# EAGLE design Schema IoT project (EAGLE 9.6.2)
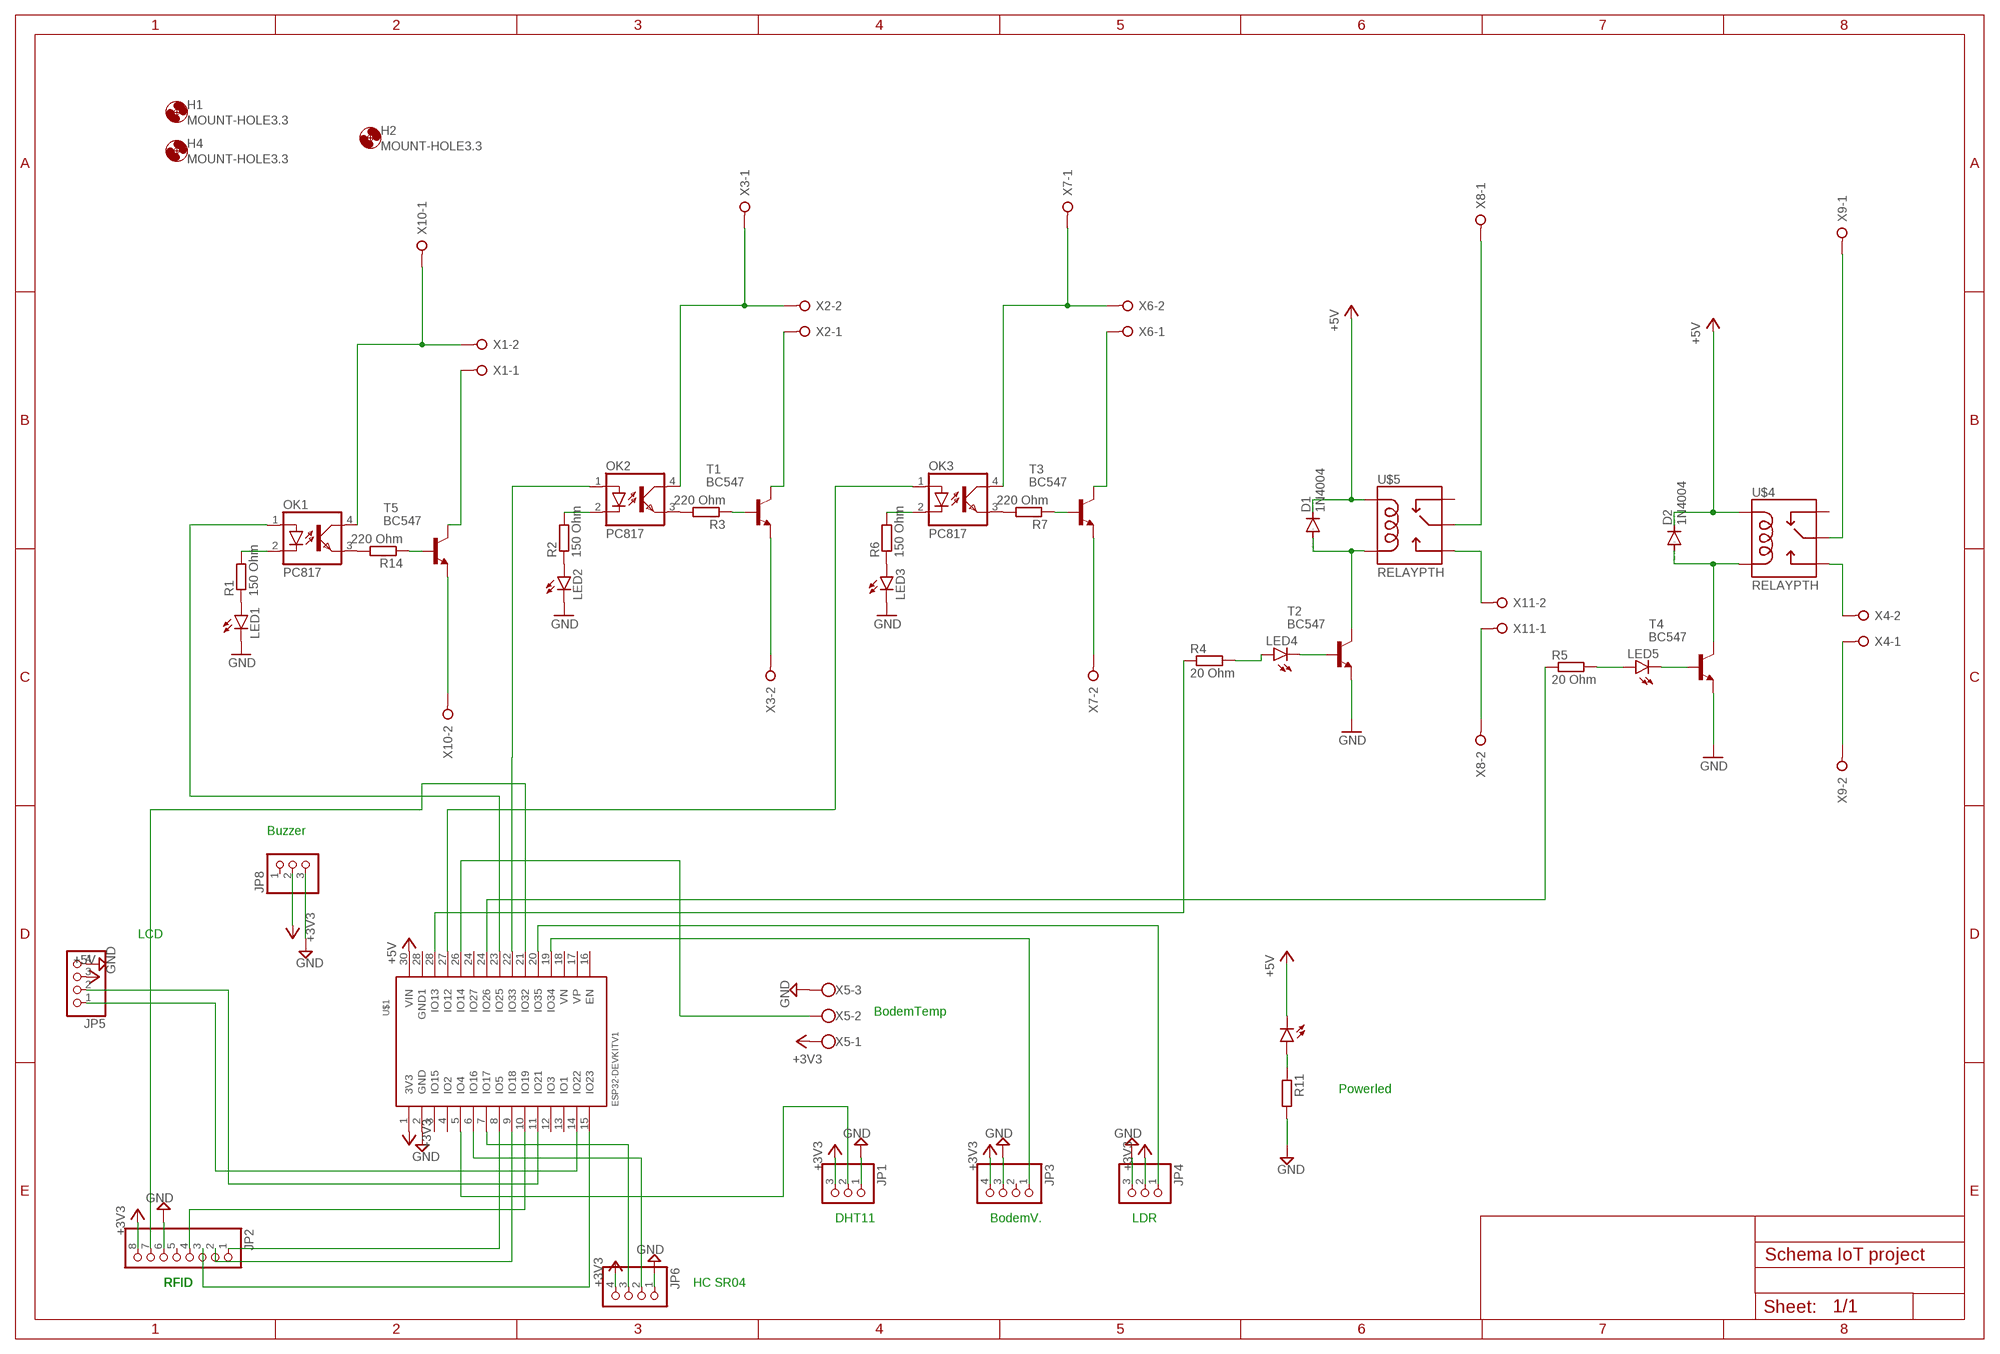
[diagram p0: schematic, sheet 1]

## Parts
D1  1N4004  [DO41-10]
D2  1N4004  [DO41-10]
H1  MOUNT-HOLE3.3  [3,3]
H2  MOUNT-HOLE3.3  [3,3]
H4  MOUNT-HOLE3.3  [3,3]
JP1  PINHD-1X3  [1X03]
JP2  PINHD-1X8  [1X08]
JP3  PINHD-1X4  [1X04]
JP4  PINHD-1X3  [1X03]
JP5  PINHD-1X4  [1X04]
JP6  PINHD-1X4  [1X04]
JP8  PINHD-1X3  [1X03]
LED1  LED5MM  [LED5MM]
LED2  LED5MM  [LED5MM]
LED3  LED5MM  [LED5MM]
LED4  LED5MM  [LED5MM]
LED5  LED5MM  [LED5MM]
OK1  PC817  [DIL04]
OK2  PC817  [DIL04]
OK3  PC817  [DIL04]
PWRLEDRASPBERRYPI2  LED5MM  [LED5MM]
R1  150 Ohm  R-EU_0207/10  [0207/10]
R2  150 Ohm  R-EU_0207/10  [0207/10]
R3  220 Ohm  R-EU_0207/10  [0207/10]
R4  20 Ohm  R-EU_0207/10  [0207/10]
R5  20 Ohm  R-EU_0207/10  [0207/10]
R6  150 Ohm  R-EU_0207/10  [0207/10]
R7  220 Ohm  R-EU_0207/10  [0207/10]
R11  R-EU_0207/10  [0207/10]
R14  220 Ohm  R-EU_0207/10  [0207/10]
T1  BC547  [TO92]
T2  BC547  [TO92]
T3  BC547  [TO92]
T4  BC547  [TO92]
T5  BC547  [TO92]
U$1  ESP32DEVKITV1  [ESP32-DEVKITV1]
U$4  RELAYPTH  [SRD-05VDC-SL-C]
U$5  RELAYPTH  [SRD-05VDC-SL-C]
X1  W237-02P  [W237-132]
X2  W237-02P  [W237-132]
X3  W237-02P  [W237-132]
X4  W237-02P  [W237-132]
X5  W237-103  [W237-103]
X6  W237-02P  [W237-132]
X7  W237-02P  [W237-132]
X8  W237-02P  [W237-132]
X9  W237-02P  [W237-132]
X10  W237-02P  [W237-132]
X11  W237-02P  [W237-132]

## Nets
+3V3: JP1.3 JP2.8 JP3.4 JP4.2 JP6.4 JP8.2 U$1.1(3V3) X5.1
+5V: D1.C D2.C JP5.3 PWRLEDRASPBERRYPI2.K(C) U$1.30(VIN) U$4.COIL1 U$5.COIL1
GND: JP1.1 JP2.6 JP3.3 JP4.3 JP5.4 JP6.1 JP8.3 LED1.K(C) LED2.K(C) LED3.K(C) R11.2 T2.1(E) T4.1(E) U$1.2(GND) X5.3
N$1: OK1.4(COL) X1.2 X10.1
N$2: LED2.A R2.1
N$3: OK2.1(A)
N$4: D1.A T2.3(C) U$5.COIL0
N$5: OK2.4(COL) X2.2 X3.1
N$6: OK1.3(EMIT) R14.2
N$7: OK2.3(EMIT) R3.2
N$8: R3.1 T1.2(B)
N$9: T1.3(C) X2.1
N$10: D2.A T4.3(C) U$4.COIL0
N$11: JP3.1 U$1.19(IO34)
N$12: LED1.A R1.1
N$13: R14.1 T5.2(B)
N$14: T1.1(E) X3.2
N$15: PWRLEDRASPBERRYPI2.A R11.1
N$16: OK2.2(C) R2.2
N$17: T5.3(C) X1.1
N$18: LED4.K(C) T2.2(B)
N$19: R5.1 U$1.24(IO26)
N$20: LED4.A R4.2
N$21: T5.1(E) X10.2
N$22: JP5.2 U$1.11(IO21)
N$23: LED3.A R6.1
N$24: OK3.1(A) U$1.27(IO12)
N$25: U$4.SWCOMMON X9.1
N$26: U$5.SWCOMMON X8.1
N$27: OK1.2(C) R1.2
N$28: R4.1 U$1.28(IO13)
N$29: OK3.4(COL) X6.2 X7.1
N$30: U$1.22(IO33)
N$31: OK3.3(EMIT) R7.2
N$32: X8.2 X11.1
N$33: U$1.26(IO14) X5.2
N$34: JP6.3 U$1.7(IO17)
N$35: JP4.1 U$1.20(IO35)
N$36: JP2.7 U$1.21(IO32)
N$37: JP2.4 U$1.10(IO19)
N$39: JP6.2 U$1.6(IO16)
N$40: R7.1 T3.2(B)
N$41: JP1.2 U$1.5(IO4)
N$43: JP5.1 U$1.14(IO22)
N$44: T3.3(C) X6.1
N$45: U$5.SWOPEN X11.2
N$46: U$4.SWOPEN X4.2
N$47: T3.1(E) X7.2
N$48: OK3.2(C) R6.2
N$49: X4.1 X9.2
N$50: LED5.A R5.2
N$51: LED5.K(C) T4.2(B)
N$52: JP2.3 U$1.15(IO23)
N$53: JP2.2 U$1.9(IO18)
N$54: JP2.1 U$1.8(IO5)
N$58: OK1.1(A) U$1.23(IO25)
Unconnected: JP2.5 JP3.2 JP8.1 U$1.3(IO15) U$1.4(IO2) U$1.12(IO3) U$1.13(IO1) U$1.16(EN) U$1.17(VP) U$1.18(VN) U$1.24(IO27) U$1.28(GND1) U$4.SWCLOSED(SWCLOSE) U$5.SWCLOSED(SWCLOSE)

## Notes on the sheet
- Buzzer
- LCD
- BodemTemp
- Powerled
- DHT11 | BodemV. | LDR
- RFID | RFID | RFID | HC SR04

## Library data of the parts
D1 D2 = diode:1N4004: DIODE general purpose rectifier, 1 A
H1 H2 H4 = holes:MOUNT-HOLE: MOUNTING HOLE with drill center marker
JP1 JP4 JP8 = pinhead:PINHD-1X3: PIN HEADER
JP2 = pinhead:PINHD-1X8: PIN HEADER
JP3 JP5 JP6 = pinhead:PINHD-1X4: PIN HEADER
LED1-LED5 PWRLEDRASPBERRYPI2 = led:LED: LED OSRAM: - CHIPLED LG R971, LG N971, LY N971, LG Q971, LY Q971, LO R971, LY R971 LH N974, LH R974 LS Q976, LO Q976, LY Q976 LO Q996 - Hyper CHIPLED LW Q18S LB Q993, LB Q99A, LB R99A - SideLED LS A670, LO A670, LY A670, LG A670, LP A670 LB A673, LV A673, LT A673, LW A673 LH A674 LY A675 LS A676, LA A676, LO A676, LY A676, LW A676 LS A679, LY A679, LG A679 - Hyper Micro SIDELED® LS Y876, LA Y876, LO Y876, LY Y876 LT Y87S - SmartLED LW L88C, LW L88S LB L89C, LB L89S, LG L890 LS L89K, LO L89K, LY L89K LS L896, LA L896, LO L896, LY L896 - TOPLED LS T670, LO T670, LY T670, LG T670, LP T670 LSG T670, LSP T670, LSY T670, LOP T670, LYG T670 LG T671, LOG T671, LSG T671 LB T673, LV T673, LT T673, LW T673 LH T674 LS T676, LA T676, LO T676, LY T676, LB T676, LH T676, LSB T676, LW T676 LB T67C, LV T67C, LT T67C, LS T67K, LO T67K, LY T67K, LW E67C LS E67B, LA E67B, LO E67B, LY E67B, LB E67C, LV E67C, LT E67C LW T67C LS T679, LY T679, LG T679 LS T770, LO T770, LY T770, LG T770, LP T770 LB T773, LV T773, LT T773, LW T773 LH T774 LS E675, LA E675, LY E675, LS T675 LS T776, LA T776, LO T776, LY T776, LB T776 LHGB T686 LT T68C, LB T68C - Hyper Mini TOPLED® LB M676 - Mini TOPLED Santana® LG M470 LS M47K, LO M47K, LY M47K Source: http://www.osram.convergy.de LUXEON: - LUMILED® LXK2-PW12-R00, LXK2-PW12-S00, LXK2-PW14-U00, LXK2-PW14-V00 LXK2-PM12-R00, LXK2-PM12-S00, LXK2-PM14-U00 LXK2-PE12-Q00, LXK2-PE12-R00, LXK2-PE12-S00, LXK2-PE14-T00, LXK2-PE14-U00 LXK2-PB12-K00, LXK2-PB12-L00, LXK2-PB12-M00, LXK2-PB14-N00, LXK2-PB14-P00, LXK2-PB14-Q00 LXK2-PR12-L00, LXK2-PR12-M00, LXK2-PR14-Q00, LXK2-PR14-R00 LXK2-PD12-Q00, LXK2-PD12-R00, LXK2-PD12-S00 LXK2-PH12-R00, LXK2-PH12-S00 LXK2-PL12-P00, LXK2-PL12-Q00, LXK2-PL12-R00 Source: www.luxeon.com KINGBRIGHT: KA-3528ASYC Source: www.kingbright.com
OK1-OK3 = optocoupler:PC817: SHARP OPTO COUPLER; MPN: PC817X4J000F; OC_FARNELL: 9707727; OC_NEWARK: 97K7059
R1-R7 R11 R14 = rcl:R-EU_: RESISTOR, European symbol; SPICEPREFIX: R
T1-T5 = transistor:BC547: NPN TRANSISTOR
U$1 = ESP32-DEVKITV1:ESP32DEVKITV1
U$4 U$5 = SRD-05VDC-SL-C:RELAY: SPDT relay (COM-00101)
X1-X4 X6-X11 = con-wago-508:W237-02P: WAGO SREW CLAMP; OC_FARNELL: unknown; OC_NEWARK: unknown
X5 = con-wago-500:W237-103: WAGO SCREW CLAMP; MPN: 237-103; OC_FARNELL: unknown; OC_NEWARK: 18M7116

## Board
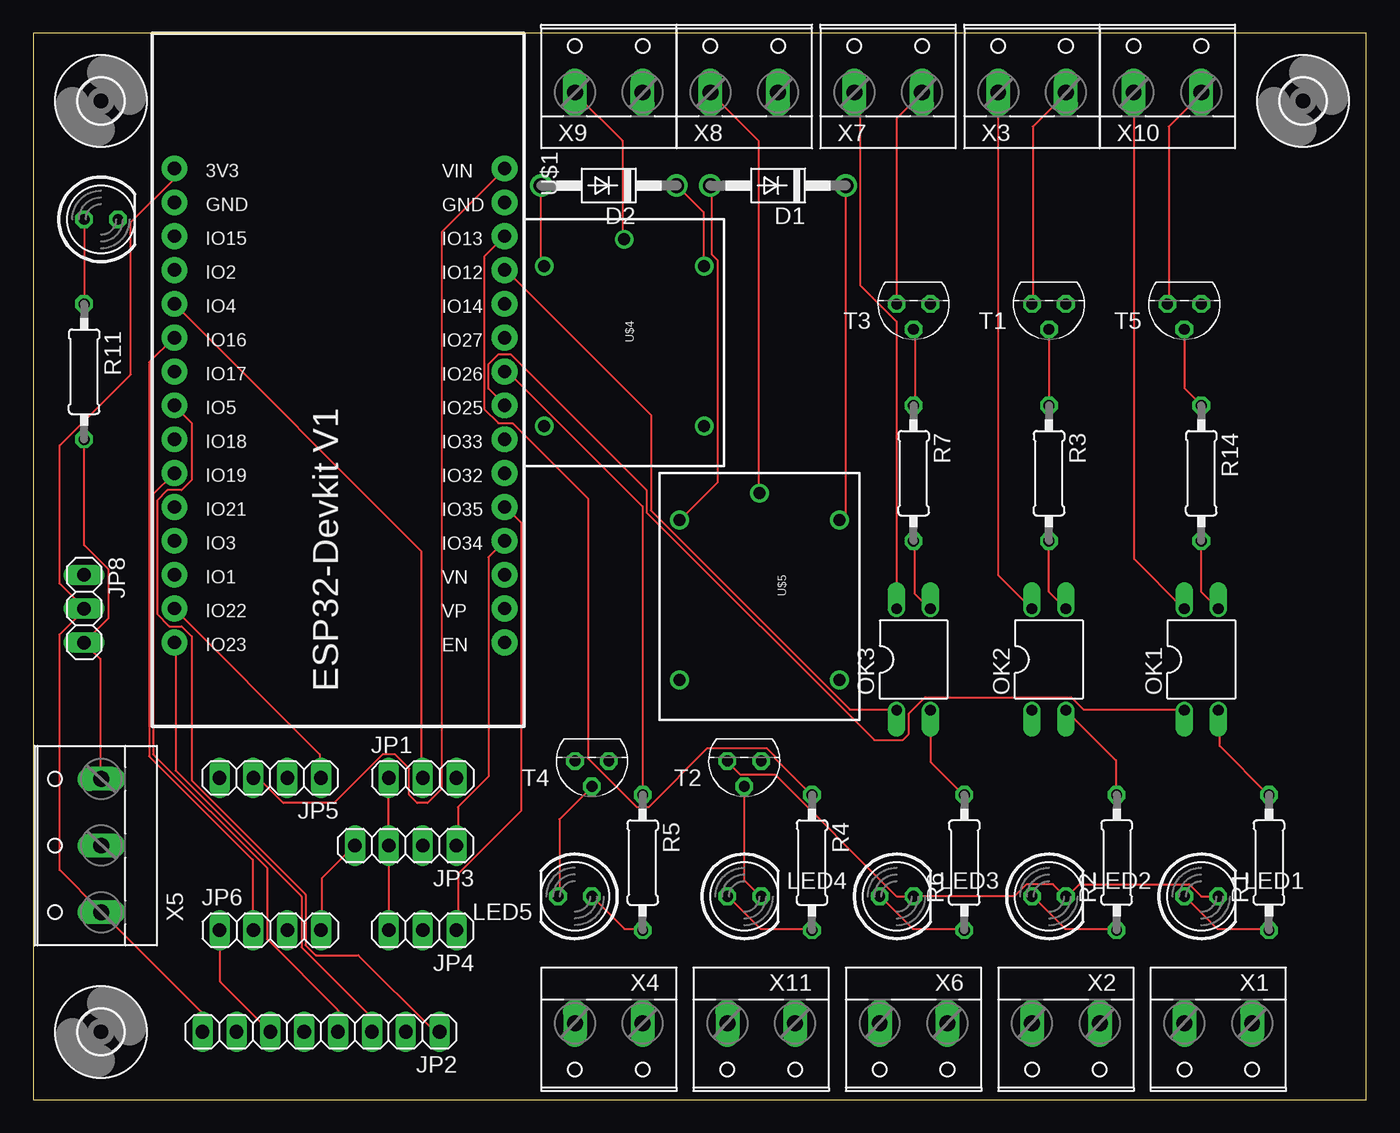
[diagram p1: board, top side]
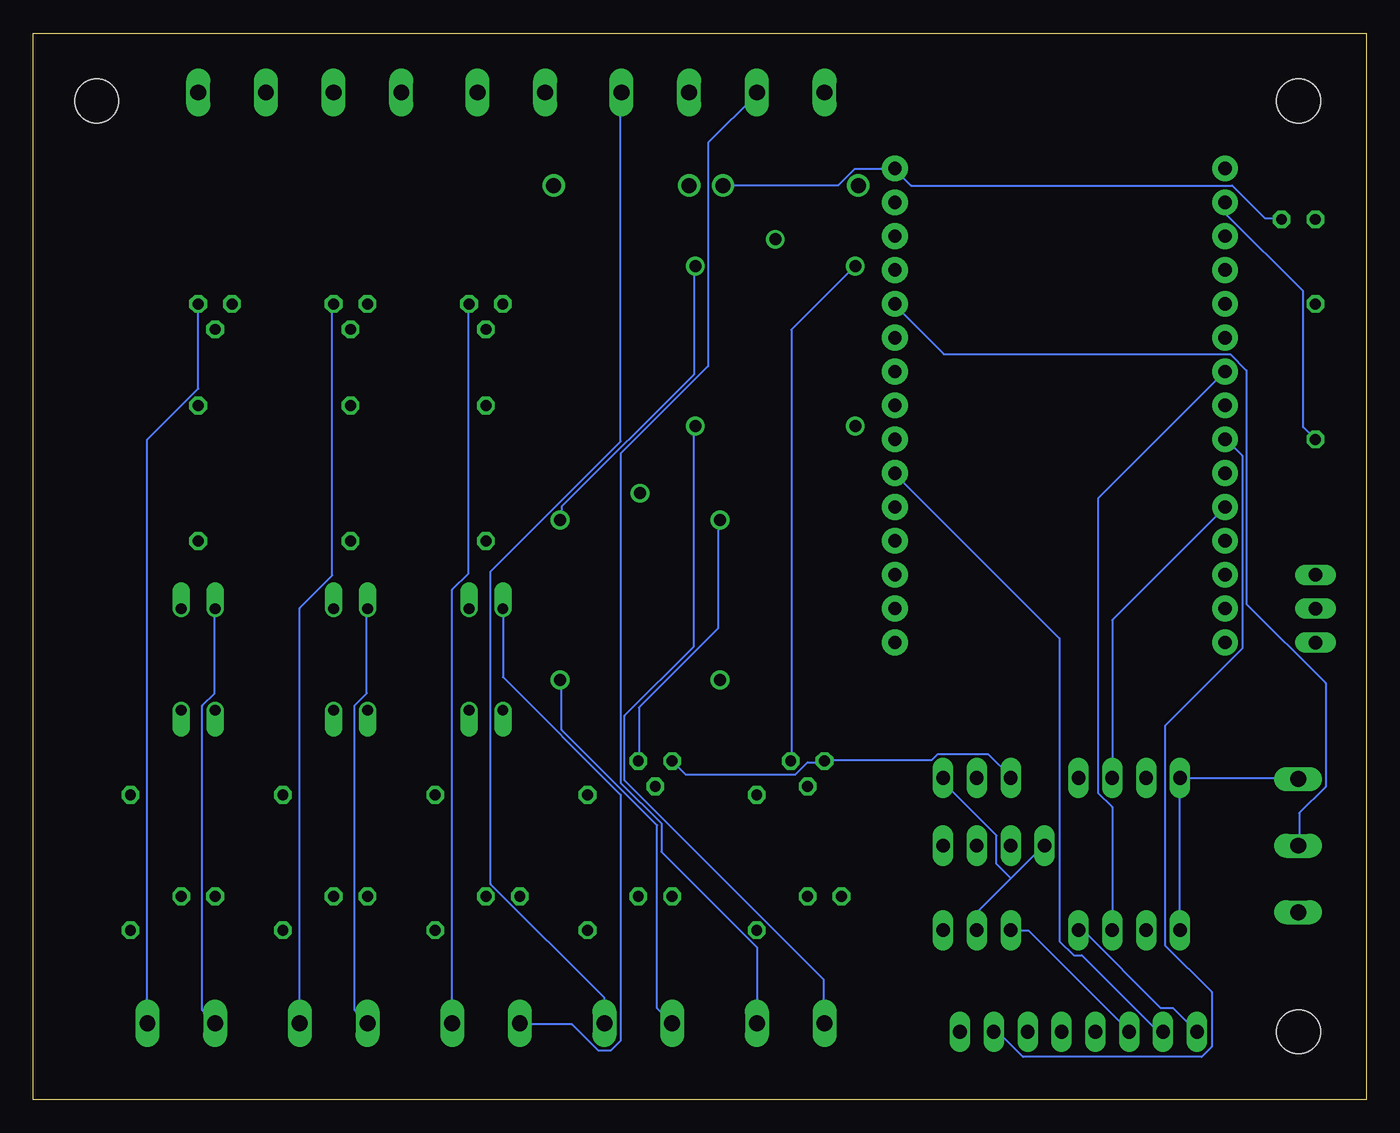
[diagram p2: board, bottom side, seen from below]

Size 100 x 80 mm. Coordinates in mm from the lower left corner, seen from the top.
Outline: 0,0 100,0 100,80 0,80 0,0
Copper layers (1*16): Top 0.035mm / dielectric 1.5mm / Bottom 0.035mm
Design rules "default": minimum track width 6mil, minimum drill 0.35mm, track to track 6mil, track to pad 6mil, pad to pad 6mil, via to via 6mil, smd to smd 6mil, copper to edge 40mil, drill to drill 6mil, minimum pad ring 10mil, minimum via ring 8mil, stop-mask expansion 4mil, vias tented up to drill 0mil, thermal gap 10mil

### Footprints (pad centres in the part's own frame; a part is rotated, then mirrored left to right if it is on the bottom)
DO41-10 = drill 1.118: A 5.08,0; C -5.08,0
3,3 = hole 3.3: 0,0
1X03 = drill 1.016 long: 1 -2.54,0; 2 0,0; 3 2.54,0
1X08 = drill 1.016 long: 1 -8.89,0; 2 -6.35,0; 3 -3.81,0; 4 -1.27,0; 5 1.27,0; 6 3.81,0; 7 6.35,0; 8 8.89,0
1X04 = drill 1.016 long: 1 -3.81,0; 2 -1.27,0; 3 1.27,0; 4 3.81,0
LED5MM = drill 0.813 octagon: A -1.27,0; K 1.27,0
DIL04 = drill 0.813 offset: 1 -1.27,-3.81; 2 1.27,-3.81; 3 1.27,3.81; 4 -1.27,3.81
0207/10 = drill 0.813 octagon: 1 -5.08,0; 2 5.08,0
TO92 = drill 0.813 octagon: 1 1.27,0; 2 0,1.905; 3 -1.27,0
ESP32-DEVKITV1 = drill 1 pad 1.93: 1 -22.87,-13.54; 2 -20.33,-13.54; 3 -17.79,-13.54; 4 -15.25,-13.54; 5 -12.71,-13.54; 6 -10.17,-13.54; 7 -7.63,-13.54; 8 -5.09,-13.54; 9 -2.55,-13.54; 10 -0.01,-13.54; 11 2.53,-13.54; 12 5.07,-13.54; 13 7.61,-13.54; 14 10.15,-13.54; 15 12.69,-13.54; 16 12.69,11.23; 17 10.15,11.23; 18 7.61,11.23; 19 5.07,11.23; 20 2.53,11.23; 21 -0.01,11.23; 22 -2.55,11.23; 23 -5.09,11.23; 24 -7.63,11.23; 25 -10.17,11.23; 26 -12.71,11.23; 27 -15.25,11.23; 28 -17.79,11.23; 29 -20.33,11.23; 30 -22.87,11.23
SRD-05VDC-SL-C = drill 0.9: COIL0 -5.39,-6.12; COIL1 -5.39,5.88; SWCLOSED 6.61,-6.12; SWCOMMON -7.39,-0.12; SWOPEN 6.61,5.88
W237-132 = drill 1.194 long: 1 -2.54,-0.635; 2 2.54,-0.635
W237-103 = drill 1.194 long: 1 -5,-1.29; 2 0,-1.29; 3 5,-1.29

### Placement (x,y rotation side)
D1  55.88,68.58 180 top
D2  43.18,68.58 180 top
H1  95.25,74.93 0 top
H2  5.08,74.93 0 top
H4  5.08,5.08 0 top
JP1  29.21,24.13 0 top
JP2  21.59,5.08 180 top
JP3  27.94,19.05 180 top
JP4  29.21,12.7 180 top
JP5  17.78,24.13 180 top
JP6  17.78,12.7 0 top
JP8  3.81,36.83 270 top
LED1  87.63,15.24 0 top
LED2  76.2,15.24 0 top
LED3  64.77,15.24 0 top
LED4  53.34,15.24 0 top
LED5  40.64,15.24 180 top
OK1  87.63,33.02 0 top
OK2  76.2,33.02 0 top
OK3  66.04,33.02 0 top
PWRLEDRASPBERRYPI2  5.08,66.04 0 top
R1  92.71,17.78 90 top
R2  81.28,17.78 90 top
R3  76.2,46.99 270 top
R4  58.42,17.78 270 top
R5  45.72,17.78 270 top
R6  69.85,17.78 90 top
R7  66.04,46.99 270 top
R11  3.81,54.61 270 top
R14  87.63,46.99 270 top
T1  76.2,59.69 180 top
T2  53.34,25.4 180 top
T3  66.04,59.69 180 top
T4  41.91,25.4 180 top
T5  86.36,59.69 180 top
U$1  24.13,46.99 270 top
U$4  44.45,57.15 270 top
U$5  54.61,38.1 270 top
X1  88.9,5.08 180 top
X2  77.47,5.08 180 top
X3  74.93,76.2 0 top
X4  43.18,5.08 180 top
X5  3.81,19.05 90 top
X6  66.04,5.08 180 top
X7  64.14,76.2 0 top
X8  53.34,76.2 0 top
X9  43.18,76.2 0 top
X10  85.09,76.2 0 top
X11  54.61,5.08 180 top

### Tracks (layer width: path | path; a pad name or v marks a point on that pad's centre or on a via)
+3V3
  Top 0.152: JP6.4 21.64,12.8 21.64,16.61 24.08,19.05 JP3.4 | JP2.8 12.65,5.18 12.65,6.55 5.18,14.02 X5.1 5.03,14.17 1.98,17.22 1.98,34.9 3.81,36.73 JP8.2 3.81,36.88 1.98,38.71 1.98,49.07 7.32,54.41 7.32,65.84 10.52,69.04 10.52,69.8 U$1.1
  Bottom 0.152: 26.67,16.61 24.23,19.05 JP3.4 | 26.67,16.61 29.11,14.17 29.11,12.8 JP4.2 | 26.67,16.61 27.74,17.68 27.74,19.81 31.7,23.77 31.7,24.08 JP1.3 | JP2.8 14.48,6.86 15.39,6.86 21.18,12.65 21.49,12.65 JP6.4
+5V
  Top 0.152: U$4.COIL1 50.29,62.64 50.29,66.6 48.31,68.58 D2.C | D1.C 60.96,44.04 60.5,43.59 U$5.COIL1 | JP5.3 16.61,24.08 16.92,24.08 18.75,22.25 22.55,22.25 26.21,25.91 27.13,25.91 28.19,24.84 28.19,22.86 28.8,22.25 29.57,22.25 30.63,23.32 30.63,65.08 35.36,69.8 U$1.30
  Bottom 0.152: U$5.COIL1 60.35,43.59 60.35,44.5 50.44,54.41 50.44,62.48 U$4.COIL1 | PWRLEDRASPBERRYPI2.K 6.4,66.14 7.62,66.14 10.06,68.58 34.14,68.58 35.36,69.8 U$1.30 35.51,69.8 38.41,69.8 39.62,68.58 D2.C
GND
  Top 0.152: LED1.K 87.63,15.24 86.72,16.15 78.49,16.15 77.57,15.24 LED2.K 77.42,15.24 76.5,16.15 74.52,16.15 73.61,15.24 LED3.K 64.77,15.24 55.63,24.38 53.03,24.38 52.12,25.3 T2.1 | JP4.3 JP3.3 JP1.1 | JP2.6 14.02,8.84 14.02,12.65 JP6.1 | R11.2 3.81,41.6 5.64,39.78 5.64,36.12 JP8.3 5.03,33.07 5.03,24.08 X5.3
  Bottom 0.152: T2.1 51.05,24.38 42.82,24.38 41.91,25.3 40.69,25.3 T4.1 40.54,25.45 32.61,25.45 32.16,25.91 28.35,25.91 26.67,24.23 JP1.1 | X5.3 5.18,24.08 13.87,24.08 JP5.4 14.02,24.08 14.02,12.8 JP6.1 | R11.2 4.72,50.44 4.72,60.66 10.52,66.45 10.52,67.21 U$1.2 | JP4.3 26.67,12.65 25.3,12.65 17.83,5.18 JP2.6
N$1
  Top 0.152: X10.1 82.6,75.44 82.6,40.54 86.26,36.88 OK1.4
  Bottom 0.152: OK1.4 86.41,36.73 86.41,30.48 87.33,29.57 87.33,6.71 86.41,5.79 X1.2
N$2
  Top 0.152: R2.1 81.23,12.8 77.42,12.8 74.98,15.24 LED2.A
N$4
  Top 0.152: D1.A 50.9,68.58 50.9,63.4 51.36,62.94 51.36,46.33 48.62,43.59 U$5.COIL0
  Bottom 0.152: T2.3 54.56,25.45 54.56,29.41 48.62,35.36 48.62,43.43 U$5.COIL0
N$5
  Top 0.152: X3.1 72.39,39.32 74.83,36.88 OK2.4
  Bottom 0.152: OK2.4 74.98,36.73 74.98,30.48 75.89,29.57 75.89,6.71 74.98,5.79 X2.2
N$6
  Top 0.152: R14.2 87.63,38.1 OK1.3
N$7
  Top 0.152: R3.2 76.2,38.1 OK2.3
N$8
  Top 0.152: T1.2 R3.1
N$9
  Bottom 0.152: X2.1 80.01,36.88 77.57,39.32 77.57,59.59 T1.3
N$10
  Top 0.152: D2.A 38.1,62.79 38.25,62.64 U$4.COIL0
  Bottom 0.152: T4.3 43.13,25.45 43.13,57.76 38.41,62.48 U$4.COIL0
N$11
  Top 0.152: JP3.1 31.85,19.05 31.85,21.95 34.14,24.23 34.14,40.69 U$1.19
N$12
  Top 0.152: R1.1 92.66,12.8 88.85,12.8 86.41,15.24 LED1.A
N$13
  Top 0.152: T5.2 86.41,57.76 86.41,53.34 87.63,52.12 R14.1
N$14
  Top 0.152: T1.1 74.98,59.74 74.98,73 77.42,75.44 X3.2
N$15
  Top 0.152: PWRLEDRASPBERRYPI2.A R11.1
N$16
  Top 0.152: OK2.2 81.23,25.45 81.23,22.86 R2.2
N$17
  Bottom 0.152: T5.3 87.63,53.34 91.44,49.53 X1.1
N$18
  Top 0.152: T2.2 53.34,16.46 54.56,15.24 LED4.K
N$19
  Top 0.152: R5.1 45.72,44.5 35.51,54.71 U$1.24
N$20
  Top 0.152: R4.2 58.37,12.8 54.56,12.8 52.12,15.24 LED4.A
N$21
  Top 0.152: T5.1 85.19,59.74 85.19,73 87.63,75.44 X10.2
N$22
  Bottom 0.152: JP5.2 19.05,35.97 10.67,44.35 U$1.11
N$23
  Top 0.152: R6.1 69.8,12.8 65.99,12.8 63.55,15.24 LED3.A
N$24
  Top 0.152: OK3.1 64.77,29.26 61.27,29.26 46.33,44.2 46.33,51.36 35.51,62.18 U$1.27
N$25
  Top 0.152: U$4.SWCOMMON 44.2,64.62 44.2,71.93 40.69,75.44 X9.1
N$26
  Top 0.152: U$5.SWCOMMON 54.41,45.57 54.41,71.93 50.9,75.44 X8.1
N$27
  Top 0.152: OK1.2 89,29.11 89,26.52 92.66,22.86 R1.2
N$28
  Top 0.152: R4.1 58.37,22.86 55.63,25.6 55.63,25.76 55.02,26.36 50.6,26.36 46.18,21.95 45.26,21.95 41.6,25.6 41.6,45.11 35.97,50.75 34.9,50.75 33.83,51.82 33.83,63.25 U$1.28
N$29
  Top 0.152: OK3.4 64.77,58.37 62.03,61.11 62.03,75.13 X7.1
  Bottom 0.152: OK3.4 64.77,31.7 55.93,22.86 55.93,4.42 56.69,3.66 57.61,3.66 59.59,5.64 63.4,5.64 X6.2
N$31
  Top 0.152: R7.2 66.14,41.91 66.14,37.95 67.21,36.88 OK3.3
N$32
  Bottom 0.152: X11.1 57.15,7.62 65.68,16.15 65.68,39.62 55.93,49.38 55.93,75.44 X8.2
N$33
  Bottom 0.152: X5.2 5.03,19.05 5.03,21.49 3.05,23.47 3.05,31.24 8.99,37.19 8.99,54.71 10.21,55.93 31.7,55.93 35.36,59.59 U$1.26
N$34
  Bottom 0.152: JP6.3 19.05,21.95 20.12,23.01 20.12,45.11 10.67,54.56 U$1.7
N$35
  Top 0.152: JP4.1 31.85,12.8 31.85,16.92 36.58,21.64 36.58,43.28 35.51,44.35 U$1.20
N$36
  Bottom 0.152: JP2.7 15.24,5.18 15.7,5.18 21.34,10.82 21.95,10.82 23.01,11.89 23.01,34.59 35.36,46.94 U$1.21
N$37
  Top 0.152: JP2.4 22.86,6.71 17.53,12.04 17.53,17.37 8.99,25.91 8.99,45.41 10.52,46.94 U$1.10
N$39
  Top 0.152: JP6.2 16.46,12.8 16.46,17.98 8.69,25.76 8.69,55.32 10.52,57.15 U$1.6
N$40
  Top 0.152: R7.1 66.14,52.12 66.14,57.76 T3.2
N$41
  Top 0.152: JP1.2 29.11,24.23 29.11,41.15 10.67,59.59 U$1.5
N$43
  Top 0.152: JP5.1 21.49,24.23 21.49,25.91 10.67,36.73 U$1.14
N$44
  Bottom 0.152: X6.1 68.58,38.25 67.36,39.47 67.36,59.59 T3.3
N$45
  Bottom 0.152: U$5.SWOPEN 60.35,31.39 60.35,27.74 53.19,20.57 53.19,6.86 52.12,5.79 X11.2
N$46
  Bottom 0.152: U$4.SWOPEN 50.44,50.44 50.44,33.98 55.63,28.8 55.63,23.93 40.69,8.99 40.69,5.79 X4.2
N$47
  Top 0.152: T3.1 64.77,73.61 66.6,75.44 X7.2
N$48
  Top 0.152: OK3.2 67.36,29.11 67.36,25.3 69.8,22.86 R6.2
N$49
  Bottom 0.152: X4.1 45.72,11.43 52.88,18.59 52.88,20.73 55.93,23.77 55.93,48.46 49.38,55.02 49.38,71.78 45.72,75.44 X9.2
N$50
  Top 0.152: LED5.A 44.35,12.8 45.72,12.8 R5.2
N$51
  Top 0.152: LED5.K 39.47,15.24 39.47,21.03 41.91,23.47 T4.2
N$52
  Top 0.152: JP2.3 25.3,5.18 25.3,6.25 20.12,11.43 20.12,15.24 10.67,24.69 10.67,34.29 U$1.15
N$53
  Bottom 0.152: JP2.2 27.89,5.03 27.58,5.03 25.76,3.2 12.34,3.2 11.58,3.96 11.58,8.08 15.09,11.58 15.09,28.04 9.3,33.83 9.3,48.31 10.52,49.53 U$1.9
N$54
  Top 0.152: JP2.1 30.48,5.18 30.02,5.18 24.38,10.82 21.18,10.82 20.42,11.58 20.42,15.39 11.89,23.93 11.89,34.75 11.12,35.51 10.21,35.51 9.3,36.42 9.3,44.96 10.06,45.72 11.12,45.72 11.89,46.48 11.89,50.75 10.67,51.97 U$1.8
N$58
  Top 0.152: OK1.1 86.26,29.26 78.79,29.26 77.88,30.18 66.9,30.18 65.68,28.96 65.68,27.43 65.23,26.98 63.09,26.98 46.02,44.04 46.02,45.72 35.81,55.93 34.9,55.93 34.14,55.17 34.14,53.34 35.36,52.12 U$1.23